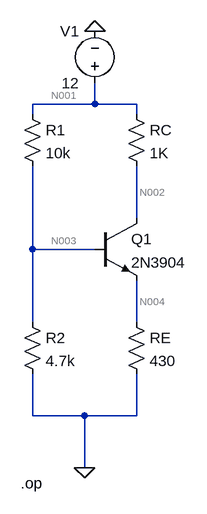
[diagram p0: schematic HLab01_BJT_dc.asc]
HLab01_BJT_dc.asc, the LTspice schematic file:
Version 4
SHEET 1 880 680
WIRE 208 64 208 32
WIRE 208 64 112 64
WIRE 272 64 208 64
WIRE 112 80 112 64
WIRE 272 80 272 64
WIRE 272 240 272 160
WIRE 112 288 112 160
WIRE 208 288 112 288
WIRE 112 400 112 288
WIRE 272 400 272 336
WIRE 112 544 112 480
WIRE 192 544 112 544
WIRE 272 544 272 480
WIRE 272 544 192 544
WIRE 192 624 192 544
FLAG 208 -48 0
FLAG 192 624 0
DATAFLAG 272 384 ""
DATAFLAG 272 192 ""
SYMBOL res 96 64 R0
SYMATTR InstName R1
SYMATTR Value 10k
SYMBOL res 96 384 R0
SYMATTR InstName R2
SYMATTR Value 4.7k
SYMBOL res 256 64 R0
SYMATTR InstName RC
SYMATTR Value 1K
SYMBOL res 256 384 R0
SYMATTR InstName RE
SYMATTR Value 430
SYMBOL voltage 208 48 R180
WINDOW 0 24 96 Left 2
WINDOW 3 24 16 Left 2
WINDOW 123 0 0 Left 0
WINDOW 39 0 0 Left 0
SYMATTR InstName V1
SYMATTR Value 12
SYMBOL npn 208 240 R0
SYMATTR InstName Q1
SYMATTR Value 2N3904
TEXT 94 648 Left 2 !.op

The netlist it stands for:
* HLab01_BJT_dc.asc
R1 N001 N003 10k
R2 N003 0 4.7k
RC N001 N002 1K
RE N004 0 430
V1 N001 0 12
Q1 N002 N003 N004 0 2N3904
.model NPN NPN
.model PNP PNP
.lib standard.bjt
.op
.backanno
.end

* Results of the author's LTspice run, read from the files saved beside the schematic
* Operating Point:
*   V(n001) = 12 V
*   V(n003) = 3.761 V
*   V(n002) = 4.922 V
*   V(n004) = 3.054 V
*   Ic(Q1) = 7.078 mA
*   Ib(Q1) = 23.73 µA
*   Ie(Q1) = -7.102 mA
*   I(Re) = 7.102 mA
*   I(Rc) = 7.078 mA
*   I(R2) = 800.2 µA
*   I(R1) = 823.9 µA
*   I(V1) = -7.902 mA
* From the log:
*   Semiconductor Device Operating Points:
*                           --- Bipolar Transistors ---
*   Name:       q1
*   Model:    2n3904
*   Ib:       2.37e-05
*   Ic:       7.08e-03
*   Vbe:      7.07e-01
*   Vbc:     -1.16e+00
*   Vce:      1.87e+00
*   BetaDC:   2.98e+02
*   Gm:       2.69e-01
*   Rpi:      1.09e+03
*   Rx:       2.00e+01
*   Ro:       1.43e+04
*   Cbe:      1.07e-10
*   Cbc:      2.94e-12
*   Cjs:      0.00e+00
*   BetaAC:   2.93e+02
*   Cbx:      0.00e+00
*   Ft:       3.89e+08